# EasyEDA schematic SCH_DIY PowerBank v3_2023-05-30.json
TITLE: Sheet_1; REV: 1.0; Date: 2023-05-30; Sheet: 1/1; Drawn By: azlan777; Company: Your Company
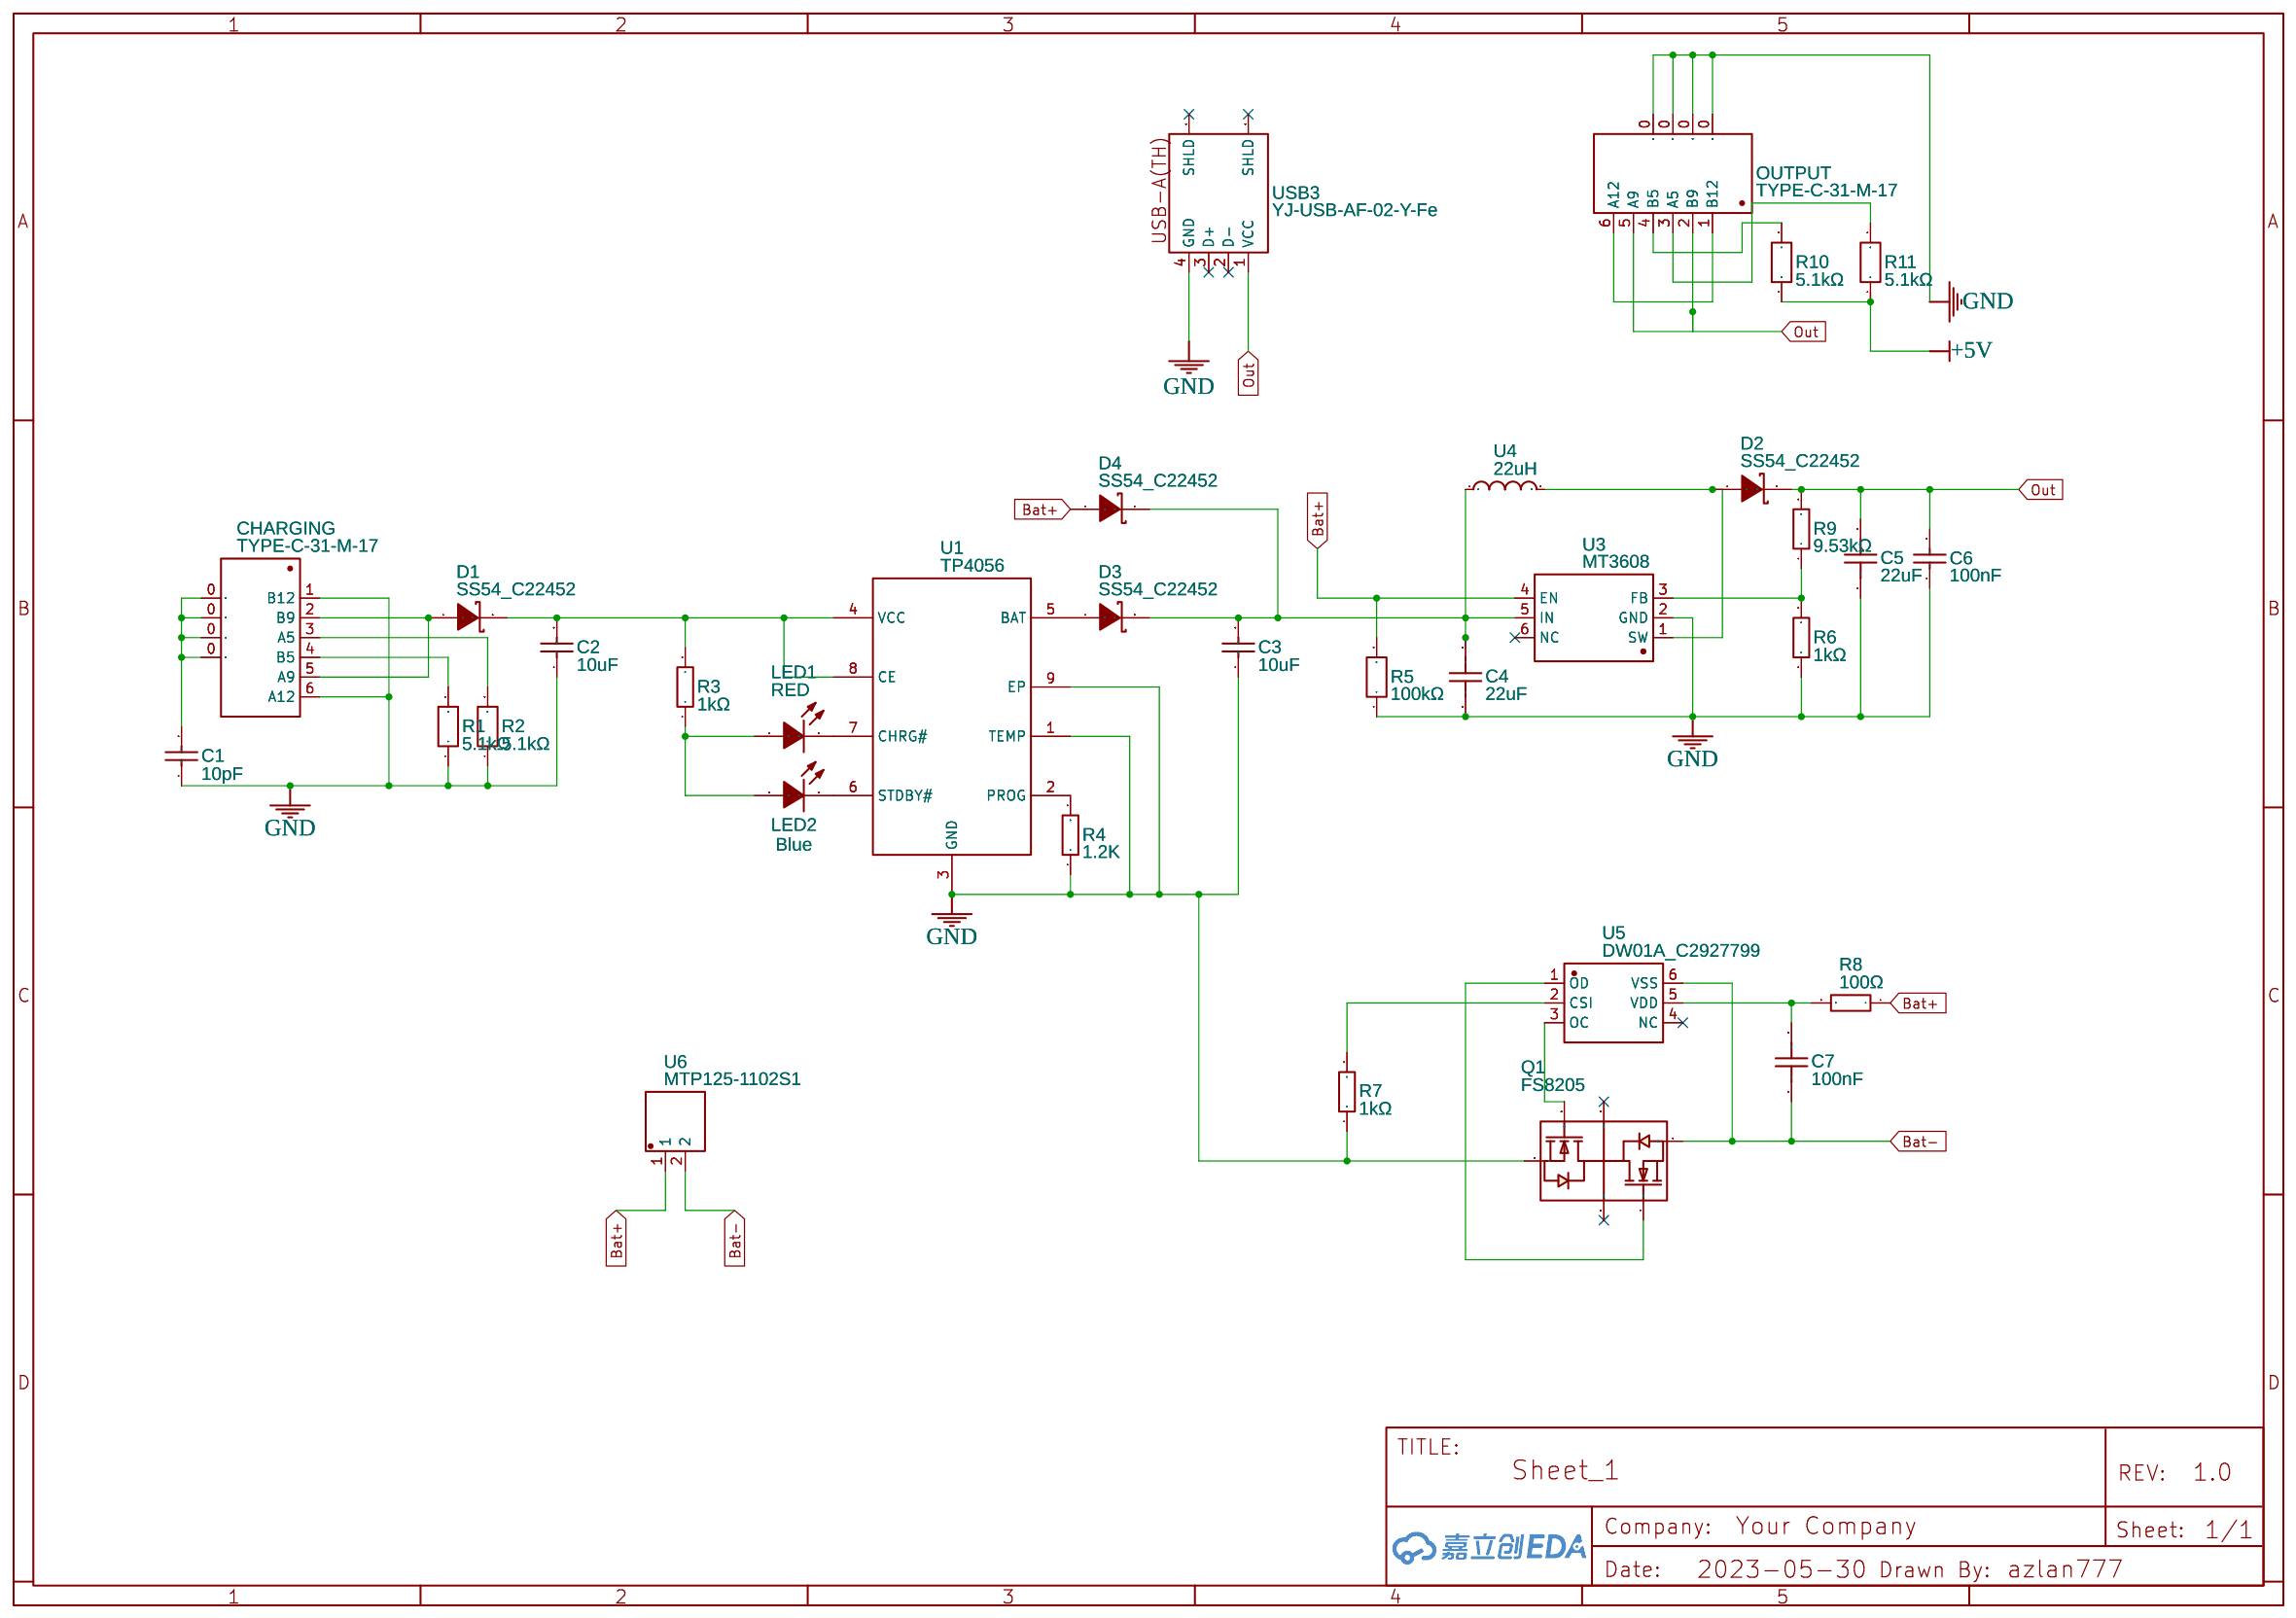
[diagram p0: schematic sheet]

## Parts
C1  10pF  [C0603]
C2  10uF  [C1206]
C3  10uF  [C1206]
C4  22uF  [C0805]
C5  22uF  [C0805]
C6  100nF  [C0402]
C7  100nF  [C0603]
CHARGING  TYPE-C-31-M-17  [USB-C-SMD_10P-P1.00-L6.8-W8.9]
D1  SS54_C22452  [SMA_L4.4-W2.8-LS5.4-R-RD]
D2  SS54_C22452  [SMA_L4.4-W2.8-LS5.4-R-RD]
D3  SS54_C22452  [SMA_L4.4-W2.8-LS5.4-R-RD]
D4  SS54_C22452  [SMA_L4.4-W2.8-LS5.4-R-RD]
LED1  RED  [LED0603-R-RD_RED]
LED2  Blue  [LED0603-R-RD_BLUE]
OUTPUT  TYPE-C-31-M-17  [USB-C-SMD_10P-P1.00-L6.8-W8.9]
Q1  FS8205  [SOT-23-6_L2.9-W1.6-P0.95-LS2.8-BR]
R1  5.1kΩ  [R0603]
R2  5.1kΩ  [R0603]
R3  1kΩ  [R0402]
R4  1.2K  [R0402]
R5  100kΩ  [R1206]
R6  1kΩ  [R0402]
R7  1kΩ  [R0402]
R8  100Ω  [R0603]
R9  9.53kΩ  [R0805]
R10  5.1kΩ  [R0603]
R11  5.1kΩ  [R0603]
U1  TP4056  [ESOP-8_L4.9-W3.9-P1.27-LS6.0-BL-EP]
U3  MT3608  [SOT-23-6_L2.9-W1.6-P0.95-LS2.8-BL]
U4  22uH  [IND-SMD_L11.0-W10.0]
U5  DW01A_C2927799  [SOT-23-6_L2.9-W1.6-P0.95-LS2.8-BL]
U6  MTP125-1102S1  [HDR-TH_2P-P2.54-V-M-1]
USB3  YJ-USB-AF-02-Y-Fe  [USB-A-TH_USB-A-F-90]

## Library data of the parts
C1 = 0603CG100J101NT: Supplier: LCSC; Manufacturer: FH(风华); Supplier Part: C56033; JLCPCB Part Class: Extended Part
C2 C3 = CL31A106KBHNNNE: Supplier: LCSC; Manufacturer: SAMSUNG(三星); Supplier Part: C13585; JLCPCB Part Class: Basic Part
C4 C5 = CL21A226MAQNNNE: Supplier: LCSC; Manufacturer: SAMSUNG(三星); Supplier Part: C45783; JLCPCB Part Class: Basic Part
C6 = CL05B104KO5NNNC: Supplier: LCSC; Manufacturer: SAMSUNG(三星); Supplier Part: C1525; JLCPCB Part Class: Basic Part
C7 = CC0603KRX7R9BB104: Supplier: LCSC; Manufacturer: YAGEO(国巨); Supplier Part: C14663; JLCPCB Part Class: Basic Part
CHARGING OUTPUT = TYPE-C-31-M-17: Supplier: LCSC; Supplier Part: C283540; Manufacturer: 韩国韩荣; Contributor: LCSC; JLCPCB Part Class: Extended Part
D1-D4 = SS54_C22452: Supplier: LCSC; Manufacturer Part: SS54; Manufacturer: MDD; Supplier Part: C22452; JLCPCB Part Class: Basic Part
LED1 = VLMS1300-GS08: Supplier: LCSC; Supplier Part: C83242; Manufacturer: VISHAY(威世); Contributor: LCSC; JLCPCB Part Class: Extended Part
LED2 = 19-217/BHC-ZM1N2TY/3T(GDB): Supplier: LCSC; Supplier Part: C131256; Manufacturer: EVERLIGHT(亿光); Contributor: LCSC; JLCPCB Part Class: Extended Part
Q1 = FS8205: Supplier: LCSC; Manufacturer: FORTUNE(富晶); Supplier Part: C32254; JLCPCB Part Class: Extended Part
R1 R2 R10 R11 = TC0350D5101T5E: Supplier: LCSC; Supplier Part: C415076; Manufacturer: UNI-ROYAL(厚声); Resistance (Ohms): 5.1K; Contributor: LCSC; JLCPCB Part Class: Extended Part
R3 R6 R7 = 0402WGF1001TCE: Supplier: LCSC; Manufacturer: UNI-ROYAL(厚声); Supplier Part: C11702; Resistance (Ohms): 1K; JLCPCB Part Class: Basic Part
R4 = AC0402FR-071K2L: Supplier: LCSC; Manufacturer: YAGEO(国巨); Contributor: LCSC; Supplier Part: C144793; JLCPCB Part Class: Extended Part; Resistance: 1.2kΩ
R5 = RT1206DRD07100KL: Supplier: LCSC; Supplier Part: C723374; Manufacturer: YAGEO(国巨); Contributor: LCSC; JLCPCB Part Class: Extended Part
R8 = 0603WAF1000T5E: Supplier: LCSC; Manufacturer: UNI-ROYAL(厚声); Supplier Part: C22775; Resistance (Ohms): 100; JLCPCB Part Class: Basic Part
R9 = RMC08059.53K1%N: Supplier: LCSC; Supplier Part: C325831; Manufacturer: Tyohm(幸亚电阻); Resistance (Ohms): 9.53K; Contributor: LCSC; JLCPCB Part Class: Extended Part
U1 = TP4056: Contributor: Guest; Supplier: LCSC; Manufacturer: TOPPOWER(南京拓微); Manufacturer Part: TP4056-42-ESOP8; Supplier Part: C16581; JLCPCB Part Class: Basic Part
U3 = MT3608: Supplier: LCSC; Manufacturer: 西安航天民芯; Supplier Part: C84817; JLCPCB Part Class: Extended Part
U4 = FAUL1040-220MT: Supplier: LCSC; Supplier Part: C5298191; Manufacturer: cjiang(长江微电); link: https://atta.szlcsc.com/upload/public/pdf/source/20221201/43419F042EC034C99E4B70E898E2F3B3.pdf; Contributor: lcsc; JLCPCB Part Class: Extended Part
U5 = DW01A_C2927799: Supplier: LCSC; Supplier Part: C2927799; Manufacturer: YONGYUTAI(永裕泰); Manufacturer Part: DW01A; Contributor: LCSC; JLCPCB Part Class: Extended Part
U6 = MTP125-1102S1: Supplier: LCSC; Supplier Part: C358684; Manufacturer: MINTRON(明硕); Contributor: LCSC; JLCPCB Part Class: Extended Part
USB3 = YJ-USB-AF-02-Y-Fe: Supplier: LCSC; image: //image.lceda.cn/szlcsc/C2345.jpg; Contributor: LCSC; Supplier Part: C2345; LCSC Assembly: Yes; SMT Type: Extend; Assembly Type: manualWeld; Paste Type: expand; JLCPCB Part Class: Extended Part

## Nets
+5V: R10.1 R11.1
GND: C1.1 C2.1 C3.1 C4.1 C5.1 C6.1 CHARGING.1(B12) CHARGING.6(A12) OUTPUT.0 Q1.1(S1) R1.1 R2.1 R4.1 R5.1 R6.1 R7.1 U1.1(TEMP) U1.3(GND) U1.9(EP) U3.2(GND) USB3.4(GND)
Bat+: D4.1(A) R5.2 R8.1 U3.4(EN) U6.1
Bat-: C7.1 Q1.3(S2) U5.6(VSS) U6.2
Out: C5.2 C6.2 D2.2(K) OUTPUT.2(B9) OUTPUT.5(A9) R9.2 USB3.1(VCC)
Net-(C1-2): C1.2 CHARGING.0
Net-(C2-2): C2.2 D1.2(K) R3.2 U1.4(VCC) U1.8(CE)
Net-(C3-2): C3.2 C4.2 D3.2(K) D4.2(K) U3.5(IN) U4.1
Net-(C7-2): C7.2 R8.2 U5.5(VDD)
Net-(CHARGING-2): CHARGING.2(B9) CHARGING.5(A9) D1.1(A)
Net-(CHARGING-3): CHARGING.3(A5) R2.2
Net-(CHARGING-4): CHARGING.4(B5) R1.2
Net-(D2-1): D2.1(A) U3.1(SW) U4.2
Net-(D3-1): D3.1(A) U1.5(BAT)
Net-(LED1-1): LED1.1(A) LED2.1(A) R3.1
Net-(LED1-2): LED1.2(C) U1.7(CHRG#)
Net-(LED2-2): LED2.2(K) U1.6(STDBY#)
Net-(OUTPUT-1): OUTPUT.1(B12) OUTPUT.6(A12)
Net-(OUTPUT-3): OUTPUT.3(A5) R11.2
Net-(OUTPUT-4): OUTPUT.4(B5) R10.2
Net-(Q1-4): Q1.4(G2) U5.1(OD)
Net-(Q1-6): Q1.6(G1) U5.3(OC)
Net-(R4-2): R4.2 U1.2(PROG)
Net-(R6-2): R6.2 R9.1 U3.3(FB)
Net-(R7-2): R7.2 U5.2(CSI)

Not connected (* = marked no-connect by the designer): Q1 2(D12)* 5(D12)*; U3 6(NC)*; U5 4(NC)*; USB3 0(SHLD)* 2(D-)* 3(D+)*
